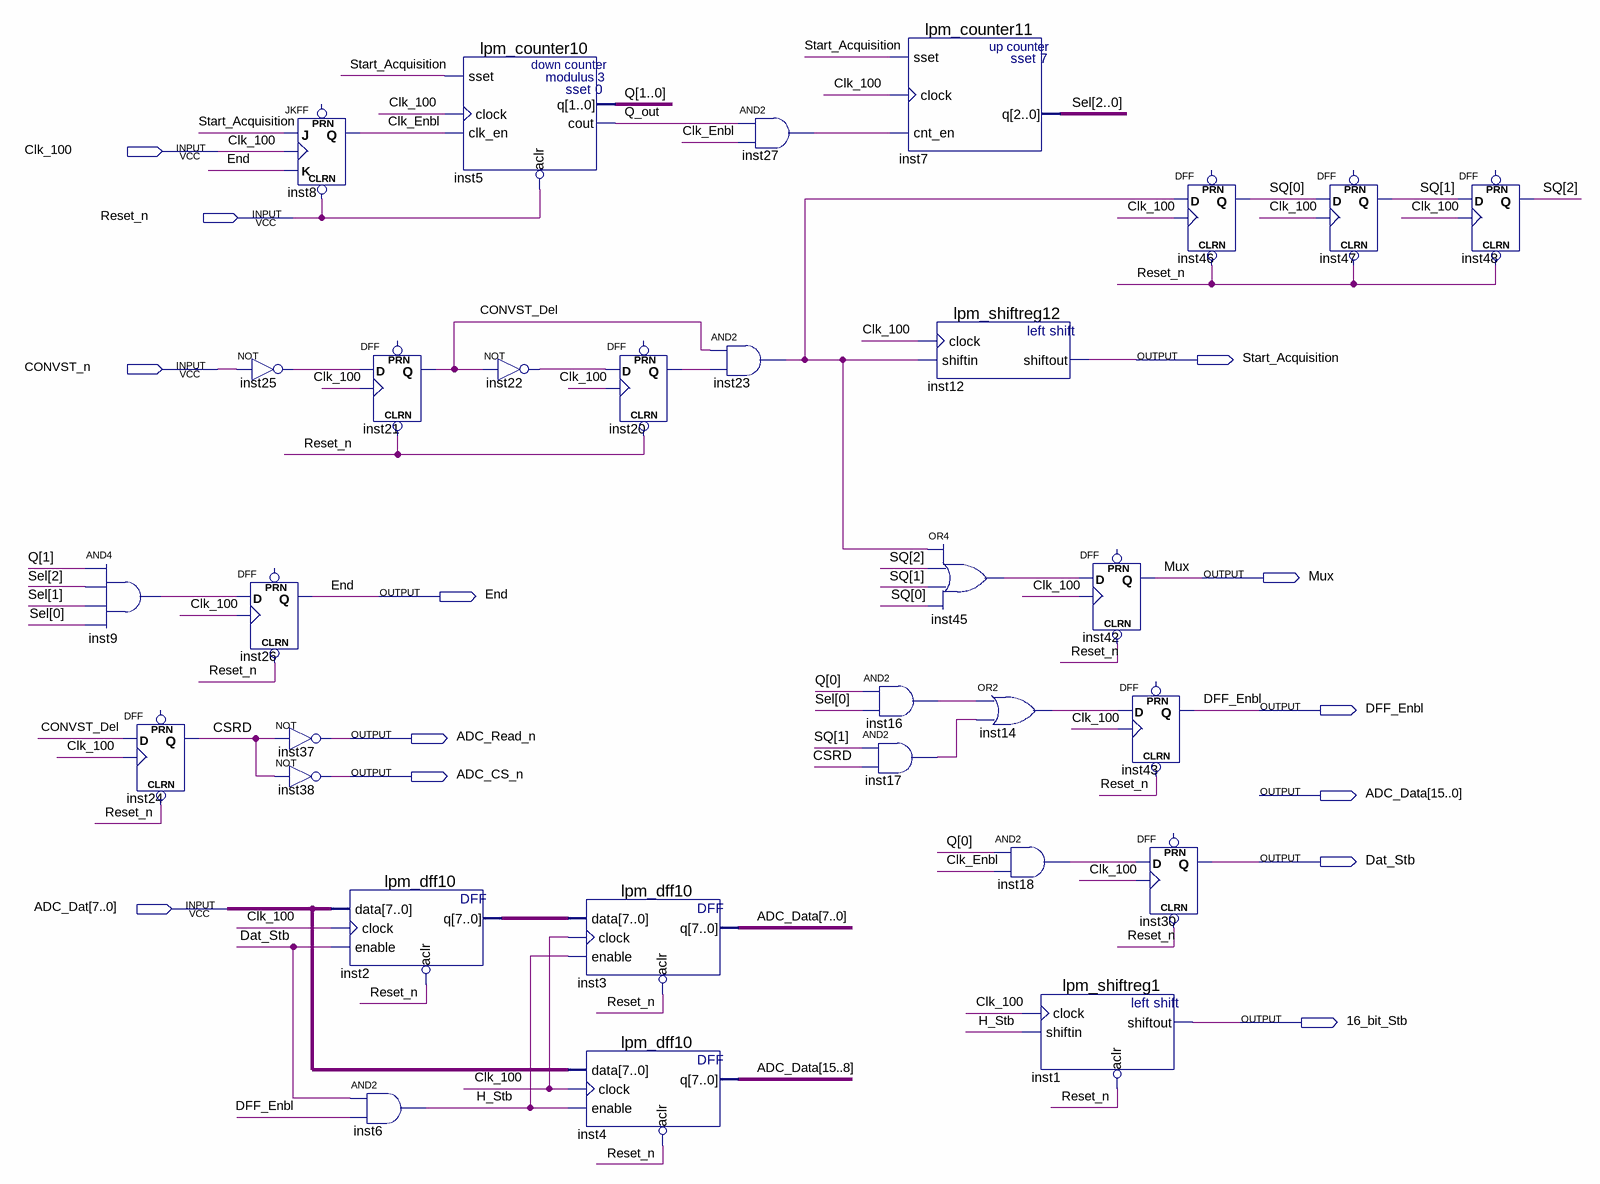
[diagram p0: schematic sheet]
// Quartus schematic Mirror.bdf as structural Verilog: 31 symbols, 13 pins
module Mirror (
  input  Clk_100,
  input  Reset_n,
  input  CONVST_n,
  input  [7:0] ADC_Dat,
  output Start_Acquisition,
  output Mux,
  output End,
  output DFF_Enbl,
  output ADC_Read_n,
  output ADC_CS_n,
  output [15:0] ADC_Data,
  output Dat_Stb,
  output \16_bit_Stb 
);

  wire Clk_Enbl, CONVST_Del, CSRD, H_Stb, inst9_out, inst14_out, inst16_out, inst17_out, inst18_out,
       inst20_q, inst22_out, inst23_out, inst25_out, inst27_out, inst45_out, Q_out;
  wire [1:0] Q;
  wire [2:0] Sel, SQ;
  wire [7:0] inst2_q;

  and inst9 (inst9_out, Q[1], Sel[2], Sel[1], Sel[0]);
  DFF inst24 (.CLRN(Reset_n), .CLK(Clk_100), .D(CONVST_Del), .Q(CSRD));  // open: PRN
  JKFF inst8 (.CLRN(Reset_n), .K(End), .J(Start_Acquisition), .CLK(Clk_100), .Q(Clk_Enbl));  // open: PRN
  not inst25 (inst25_out, CONVST_n);
  DFF inst26 (.CLRN(Reset_n), .CLK(Clk_100), .D(inst9_out), .Q(End));  // open: PRN
  not inst37 (ADC_Read_n, CSRD);
  not inst38 (ADC_CS_n, CSRD);
  DFF inst21 (.CLRN(Reset_n), .CLK(Clk_100), .D(inst25_out), .Q(CONVST_Del));  // open: PRN
  lpm_dff10 inst2 (.data(ADC_Dat), .clock(Clk_100), .enable(Dat_Stb), .aclr(~Reset_n), .q(inst2_q));
  and inst6 (H_Stb, Dat_Stb, DFF_Enbl);
  lpm_counter10 inst5 (
    .sset(Start_Acquisition), .clock(Clk_100), .clk_en(Clk_Enbl), .aclr(~Reset_n), .q(Q), .cout(Q_out));
  not inst22 (inst22_out, CONVST_Del);
  lpm_dff10 inst3 (.data(inst2_q), .clock(Clk_100), .enable(H_Stb), .aclr(~Reset_n), .q(ADC_Data[7:0]));
  lpm_dff10 inst4 (.data(ADC_Dat), .clock(Clk_100), .enable(H_Stb), .aclr(~Reset_n), .q(ADC_Data[15:8]));
  DFF inst20 (.CLRN(Reset_n), .CLK(Clk_100), .D(inst22_out), .Q(inst20_q));  // open: PRN
  and inst27 (inst27_out, Q_out, Clk_Enbl);
  and inst23 (inst23_out, CONVST_Del, inst20_q);
  lpm_counter11 inst7 (.sset(Start_Acquisition), .clock(Clk_100), .cnt_en(inst27_out), .q(Sel));
  and inst16 (inst16_out, Q[0], Sel[0]);
  and inst17 (inst17_out, SQ[1], CSRD);
  lpm_shiftreg12 inst12 (.clock(Clk_100), .shiftin(inst23_out), .shiftout(Start_Acquisition));
  or inst45 (inst45_out, inst23_out, SQ[2], SQ[1], SQ[0]);
  or inst14 (inst14_out, inst16_out, inst17_out);
  and inst18 (inst18_out, Q[0], Clk_Enbl);
  lpm_shiftreg1 inst1 (.clock(Clk_100), .shiftin(H_Stb), .aclr(~Reset_n), .shiftout(\16_bit_Stb ));
  DFF inst42 (.CLRN(Reset_n), .CLK(Clk_100), .D(inst45_out), .Q(Mux));  // open: PRN
  DFF inst43 (.CLRN(Reset_n), .CLK(Clk_100), .D(inst14_out), .Q(DFF_Enbl));  // open: PRN
  DFF inst46 (.CLRN(Reset_n), .CLK(Clk_100), .D(inst23_out), .Q(SQ[0]));  // open: PRN
  DFF inst30 (.CLRN(Reset_n), .CLK(Clk_100), .D(inst18_out), .Q(Dat_Stb));  // open: PRN
  DFF inst47 (.CLRN(Reset_n), .CLK(Clk_100), .D(SQ[0]), .Q(SQ[1]));  // open: PRN
  DFF inst48 (.CLRN(Reset_n), .CLK(Clk_100), .D(SQ[1]), .Q(SQ[2]));  // open: PRN
endmodule
